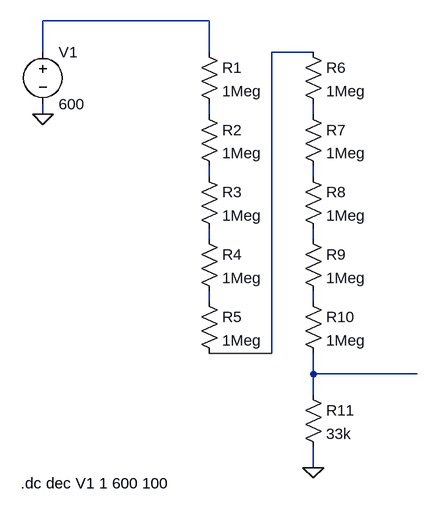
[diagram p0: schematic Draft1.asc]
Draft1.asc, the LTspice schematic file:
Version 4
SHEET 1 880 728
WIRE 144 0 -112 0
WIRE -112 48 -112 0
WIRE 144 48 144 0
WIRE 304 48 240 48
WIRE -112 144 -112 128
WIRE 144 144 144 128
WIRE 304 144 304 128
WIRE 144 240 144 224
WIRE 304 240 304 224
WIRE 144 336 144 320
WIRE 304 336 304 320
WIRE 144 432 144 416
WIRE 304 432 304 416
WIRE 240 512 240 48
WIRE 240 512 144 512
WIRE 304 544 304 512
WIRE 464 544 304 544
WIRE 304 576 304 544
WIRE 304 688 304 656
FLAG -112 144 0
FLAG 304 688 0
SYMBOL res 128 32 R0
SYMATTR InstName R1
SYMATTR Value 1Meg
SYMBOL res 128 128 R0
SYMATTR InstName R2
SYMATTR Value 1Meg
SYMBOL res 128 224 R0
SYMATTR InstName R3
SYMATTR Value 1Meg
SYMBOL res 128 320 R0
SYMATTR InstName R4
SYMATTR Value 1Meg
SYMBOL res 128 416 R0
SYMATTR InstName R5
SYMATTR Value 1Meg
SYMBOL res 288 32 R0
SYMATTR InstName R6
SYMATTR Value 1Meg
SYMBOL res 288 128 R0
SYMATTR InstName R7
SYMATTR Value 1Meg
SYMBOL res 288 224 R0
SYMATTR InstName R8
SYMATTR Value 1Meg
SYMBOL res 288 320 R0
SYMATTR InstName R9
SYMATTR Value 1Meg
SYMBOL res 288 416 R0
SYMATTR InstName R10
SYMATTR Value 1Meg
SYMBOL voltage -112 32 R0
WINDOW 123 0 0 Left 2
WINDOW 39 0 0 Left 2
SYMATTR InstName V1
SYMATTR Value 600
SYMBOL res 288 560 R0
SYMATTR InstName R11
SYMATTR Value 33k
TEXT -146 712 Left 2 !.dc dec V1 1 600 100

The netlist it stands for:
* Draft1.asc
R1 N001 N003 1Meg
R2 N003 N005 1Meg
R3 N005 N007 1Meg
R4 N007 N009 1Meg
R5 N009 N002 1Meg
R6 N002 N004 1Meg
R7 N004 N006 1Meg
R8 N006 N008 1Meg
R9 N008 N010 1Meg
R10 N010 N011 1Meg
V1 N001 0 600
R11 N011 0 33k
.dc dec V1 1 600 100
.backanno
.end

* Results of the author's LTspice run, read from the files saved beside the schematic
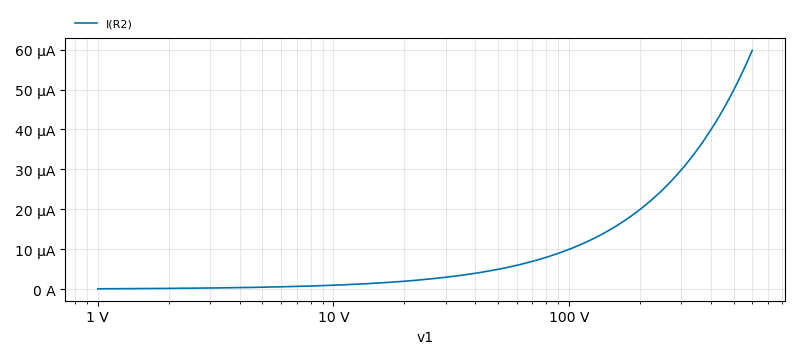
[diagram p1: DC transfer characteristic of Draft1.asc, plotted from the saved traces]
* DC transfer characteristic, 1 run:
*   I(R2): 99.67 nA at v1=1 V, 59.8 µA at v1=600 V, min 99.67 nA, max 59.8 µA